# EAGLE design PIR_LedStrip v1.0 (EAGLE 9.6.2)
CNAME: LED Strip; DESIGNER: Miroslav Pivovarsky; REV: 1.0
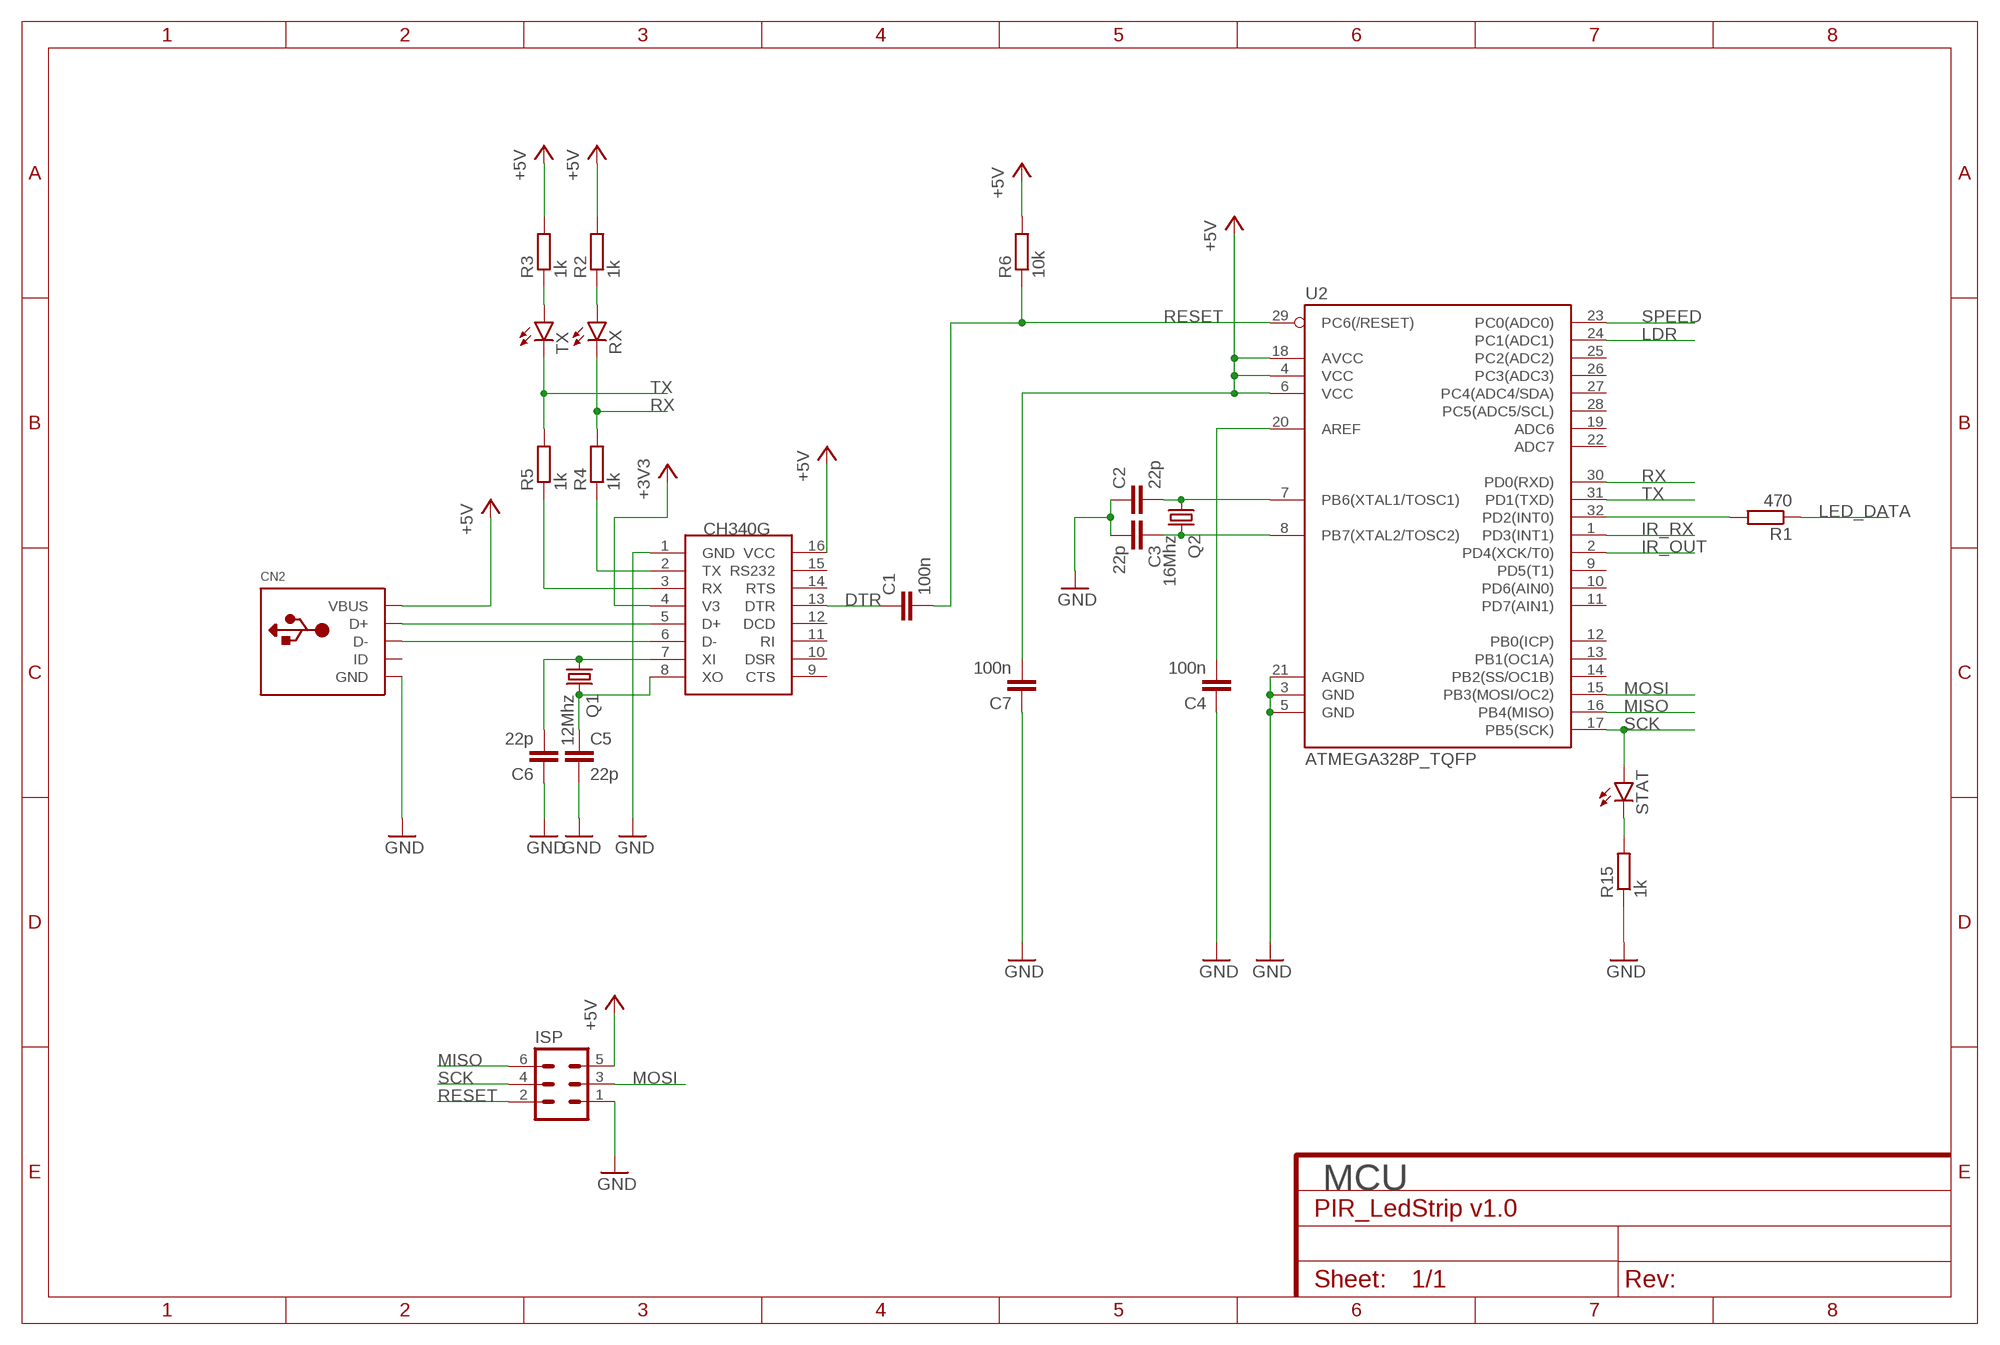
[diagram p0: schematic, sheet 1, part 1 of 2]
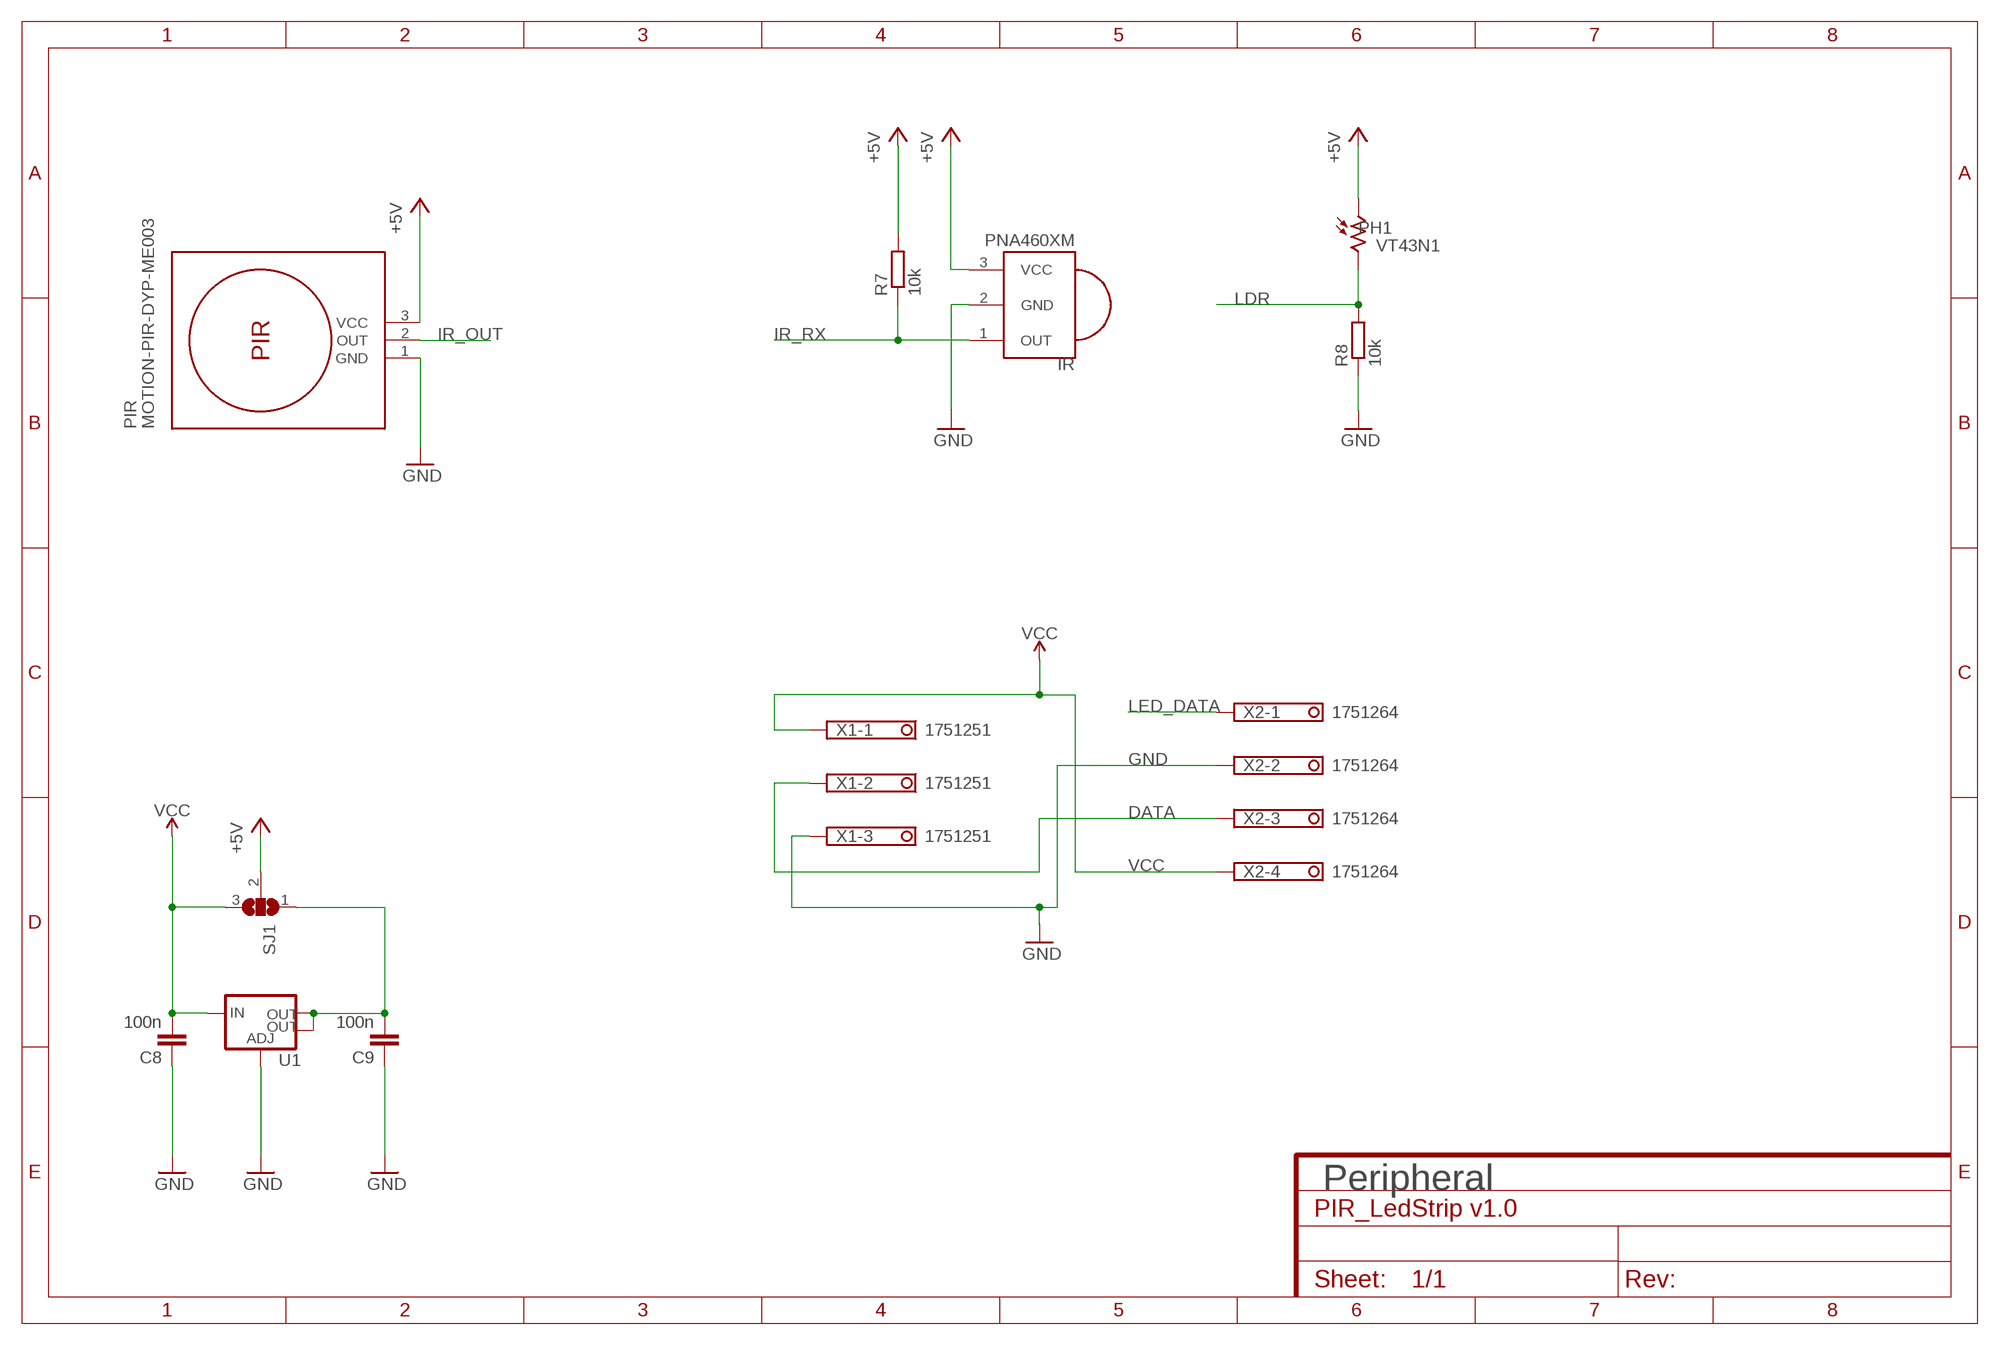
[diagram p1: schematic, sheet 1, part 2 of 2]

## Parts
C1  100n  C-EUC0603  [C0603]
C2  22p  C-EUC0603  [C0603]
C3  22p  C-EUC0603  [C0603]
C4  100n  C-EUC0603  [C0603]
C5  22p  C-EUC0603  [C0603]
C6  22p  C-EUC0603  [C0603]
C7  100n  C-EUC0603  [C0603]
C8  100n  C-EUC0603  [C0603]
C9  100n  C-EUC0603  [C0603]
CN2  USBMINIB  [USB-MINIB]
IR  PNA460XM  [PNA460XM]
ISP  MA03-2  [MA03-2]
PH1  VT43N1  [VT400]
PIR  MOTION-PIR-DYP-ME003  [MOTION-PIR-DYP-ME003]
Q1  12Mhz  CRYSTALHC49UP  [HC49UP]
Q2  16Mhz  CRYSTALHC49UP  [HC49UP]
R1  470  R-EU_R0603  [R0603]
R2  1k  R-EU_R0603  [R0603]
R3  1k  R-EU_R0603  [R0603]
R4  1k  R-EU_R0603  [R0603]
R5  1k  R-EU_R0603  [R0603]
R6  10k  R-EU_R0603  [R0603]
R7  10k  R-EU_R0603  [R0603]
R8  10k  R-EU_R0603  [R0603]
R15  1k  R-EU_R0603  [R0603]
RX  LEDSML0805  [SML0805]
SJ1  SJ2W  [SJ_2]
STAT  LEDSML0805  [SML0805]
TX  LEDSML0805  [SML0805]
U1  V_REG_LM1117SOT223  [SOT223]
U2  ATMEGA328P_TQFP  [TQFP32-08]
U$1  CH340G  [SOIC16]
X1  1751251  [1751251]
X2  1751264  [1751264]

## Nets
+3V3: U$1.4(V3)
+5V: C7.2 CN2.VBUS IR.3(VCC) ISP.5 PH1.1 PIR.3(VCC) R2.2 R3.2 R6.2 R7.2 SJ1.2 U2.4(VCC) U2.6(VCC) U2.18(AVCC) U$1.16(VCC)
DATA: X1.2 X2.3
DTR: C1.1 U$1.13(DTR)
GND: C2.1 C3.2 C4.1 C5.2 C6.1 C7.1 C8.1 C9.1 CN2.GND IR.2(GND) ISP.1 PIR.1(GND) R8.1 R15.1 U1.1(ADJ) U2.3(GND) U2.5(GND) U2.21(AGND) U$1.1(GND) X1.3 X2.2
IR_OUT: PIR.2(OUT) U2.2(PD4(XCK/T0))
IR_RX: IR.1(OUT) R7.1 U2.1(PD3(INT1))
LDR: PH1.2 R8.2 U2.24(PC1(ADC1))
LED_DATA: R1.1 X2.1
MISO: ISP.6 U2.16(PB4(MISO))
MOSI: ISP.3 U2.15(PB3(MOSI/OC2))
N$1: CN2.D+ U$1.5(D+)
N$2: R1.2 U2.32(PD2(INT0))
N$3: CN2.D- U$1.6(D-)
N$4: R5.1 U$1.3(RX)
N$5: R4.1 U$1.2(TX)
N$6: C2.2 Q2.1 U2.7(PB6(XTAL1/TOSC1))
N$7: C6.2 Q1.1 U$1.7(XI)
N$8: C5.1 Q1.2 U$1.8(XO)
N$9: R2.1 RX.A
N$10: R3.1 TX.A
N$11: C3.1 Q2.2 U2.8(PB7(XTAL2/TOSC2))
N$12: C4.2 U2.20(AREF)
N$15: C9.2 SJ1.1 U1.2(OUT) U1.4(OUT)
N$16: R15.2 STAT.C
RESET: C1.2 ISP.2 R6.1 U2.29(PC6(/RESET))
RX: R4.2 RX.C U2.30(PD0(RXD))
SCK: ISP.4 STAT.A U2.17(PB5(SCK))
SPEED: U2.23(PC0(ADC0))
TX: R5.2 TX.C U2.31(PD1(TXD))
VCC: C8.2 SJ1.3 U1.3(IN) X1.1 X2.4
Unconnected: CN2.ID U2.9(PD5(T1)) U2.10(PD6(AIN0)) U2.11(PD7(AIN1)) U2.12(PB0(ICP)) U2.13(PB1(OC1A)) U2.14(PB2(SS/OC1B)) U2.19(ADC6) U2.22(ADC7) U2.25(PC2(ADC2)) U2.26(PC3(ADC3)) U2.27(PC4(ADC4/SDA)) U2.28(PC5(ADC5/SCL)) U$1.9(CTS) U$1.10(DSR) U$1.11(RI) U$1.12(DCD) U$1.14(RTS) U$1.15(RS232)

## Notes on the sheet
- MCU | Peripheral

## Library data of the parts
C1-C9 = rcl:C-EU: CAPACITOR, European symbol; SPICEPREFIX: C
CN2 = adafruit:USB: USB Connectors USBMINIB - Surface Mount Female Mini-B USB Connector 4UConnector: 06564 By microbuilder.eu Thru-hole RA Female Mini-B USB Connector 4UConnector: 18732 By ladyada.net
IR = adafruit:PNA460XM: IR 38KHz receiver PNA4602 and related receivers http://www.ladyada.net/library/pcb/eaglelibrary.html
ISP = con-lstb:MA03-2: PIN HEADER; OC_FARNELL: unknown; OC_NEWARK: unknown
PH1 = photo-elements:VT43N: Photoconductive Cell VT400 Series Source: http://optoelectronics.perkinelmer.com/content/Datasheets/DTS_vt400seriesdatasheet.pdf
PIR = acs712:MOTION-PIR-DYP-ME003: PIR Motion Sensor Module DYP-ME003 based on BISS0001 pyroelectic detector Click here to find device on ebay.com <http://www.ebay.com/sch/dyp+me003>
Q1 Q2 = adafruit:CRYSTAL: CRYSTAL; OC_FARNELL: unknown; OC_NEWARK: unknown
R1-R8 R15 = rcl:R-EU_: RESISTOR, European symbol; SPICEPREFIX: R
RX STAT TX = led:LED: LED OSRAM: - CHIPLED LG R971, LG N971, LY N971, LG Q971, LY Q971, LO R971, LY R971 LH N974, LH R974 LS Q976, LO Q976, LY Q976 LO Q996 - Hyper CHIPLED LW Q18S LB Q993, LB Q99A, LB R99A - SideLED LS A670, LO A670, LY A670, LG A670, LP A670 LB A673, LV A673, LT A673, LW A673 LH A674 LY A675 LS A676, LA A676, LO A676, LY A676, LW A676 LS A679, LY A679, LG A679 - Hyper Micro SIDELED® LS Y876, LA Y876, LO Y876, LY Y876 LT Y87S - SmartLED LW L88C, LW L88S LB L89C, LB L89S, LG L890 LS L89K, LO L89K, LY L89K LS L896, LA L896, LO L896, LY L896 - TOPLED LS T670, LO T670, LY T670, LG T670, LP T670 LSG T670, LSP T670, LSY T670, LOP T670, LYG T670 LG T671, LOG T671, LSG T671 LB T673, LV T673, LT T673, LW T673 LH T674 LS T676, LA T676, LO T676, LY T676, LB T676, LH T676, LSB T676, LW T676 LB T67C, LV T67C, LT T67C, LS T67K, LO T67K, LY T67K, LW E67C LS E67B, LA E67B, LO E67B, LY E67B, LB E67C, LV E67C, LT E67C LW T67C LS T679, LY T679, LG T679 LS T770, LO T770, LY T770, LG T770, LP T770 LB T773, LV T773, LT T773, LW T773 LH T774 LS E675, LA E675, LY E675, LS T675 LS T776, LA T776, LO T776, LY T776, LB T776 LHGB T686 LT T68C, LB T68C - Hyper Mini TOPLED® LB M676 - Mini TOPLED Santana® LG M470 LS M47K, LO M47K, LY M47K Source: http://www.osram.convergy.de LUXEON: - LUMILED® LXK2-PW12-R00, LXK2-PW12-S00, LXK2-PW14-U00, LXK2-PW14-V00 LXK2-PM12-R00, LXK2-PM12-S00, LXK2-PM14-U00 LXK2-PE12-Q00, LXK2-PE12-R00, LXK2-PE12-S00, LXK2-PE14-T00, LXK2-PE14-U00 LXK2-PB12-K00, LXK2-PB12-L00, LXK2-PB12-M00, LXK2-PB14-N00, LXK2-PB14-P00, LXK2-PB14-Q00 LXK2-PR12-L00, LXK2-PR12-M00, LXK2-PR14-Q00, LXK2-PR14-R00 LXK2-PD12-Q00, LXK2-PD12-R00, LXK2-PD12-S00 LXK2-PH12-R00, LXK2-PH12-S00 LXK2-PL12-P00, LXK2-PL12-Q00, LXK2-PL12-R00 Source: www.luxeon.com KINGBRIGHT: KA-3528ASYC Source: www.kingbright.com
SJ1 = jumper:SJ2W: SMD solder JUMPER
U1 = SparkFun-IC-Power:V_REG_LM1117: Voltage Regulator LM1117 Standard adjustable voltage regulator but in SMD form. Spark Fun Electronics SKU : COM-00595; PROD_ID: VREG-08170
U2 = SparkFun-DigitalIC:ATMEGA328P_TQFP; PROD_ID: IC-09069
U$1 = ch340g:CH340G
X1 = con-phoenix-350:1751251: MKDS 1/ 3-3,5 Printklemme Nennstrom: 10 A Bemessungsspannung: 160 V Raster: 3,5 mm Polzahl: 3 Montageart: Löten Anschlussart: Schraubanschluss Anschlussrichtung vom Leiter zur Platine: 0° Source: http://eshop.phoenixcontact.com .. 1751251.pdf; OC_FARNELL: unknown; OC_NEWARK: unknown
X2 = con-phoenix-350:1751264: MKDS 1/ 4-3,5 Printklemme Nennstrom: 10 A Bemessungsspannung: 160 V Raster: 3,5 mm Polzahl: 4 Montageart: Löten Anschlussart: Schraubanschluss Anschlussrichtung vom Leiter zur Platine: 0° Source: http://eshop.phoenixcontact.com .. 1751264.pdf; MPN: 1751264; OC_FARNELL: unknown; OC_NEWARK: 10R0934

## Board
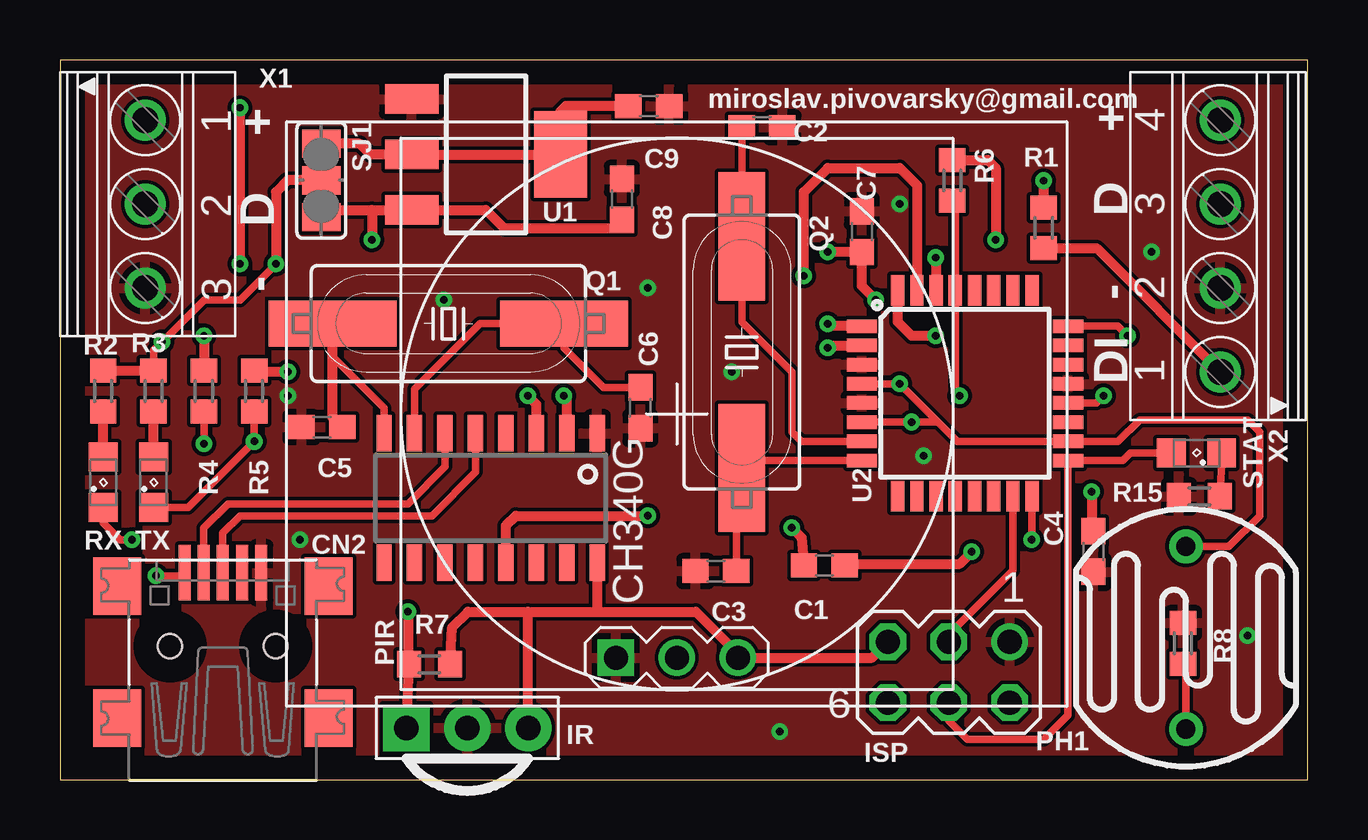
[diagram p2: board, top side]
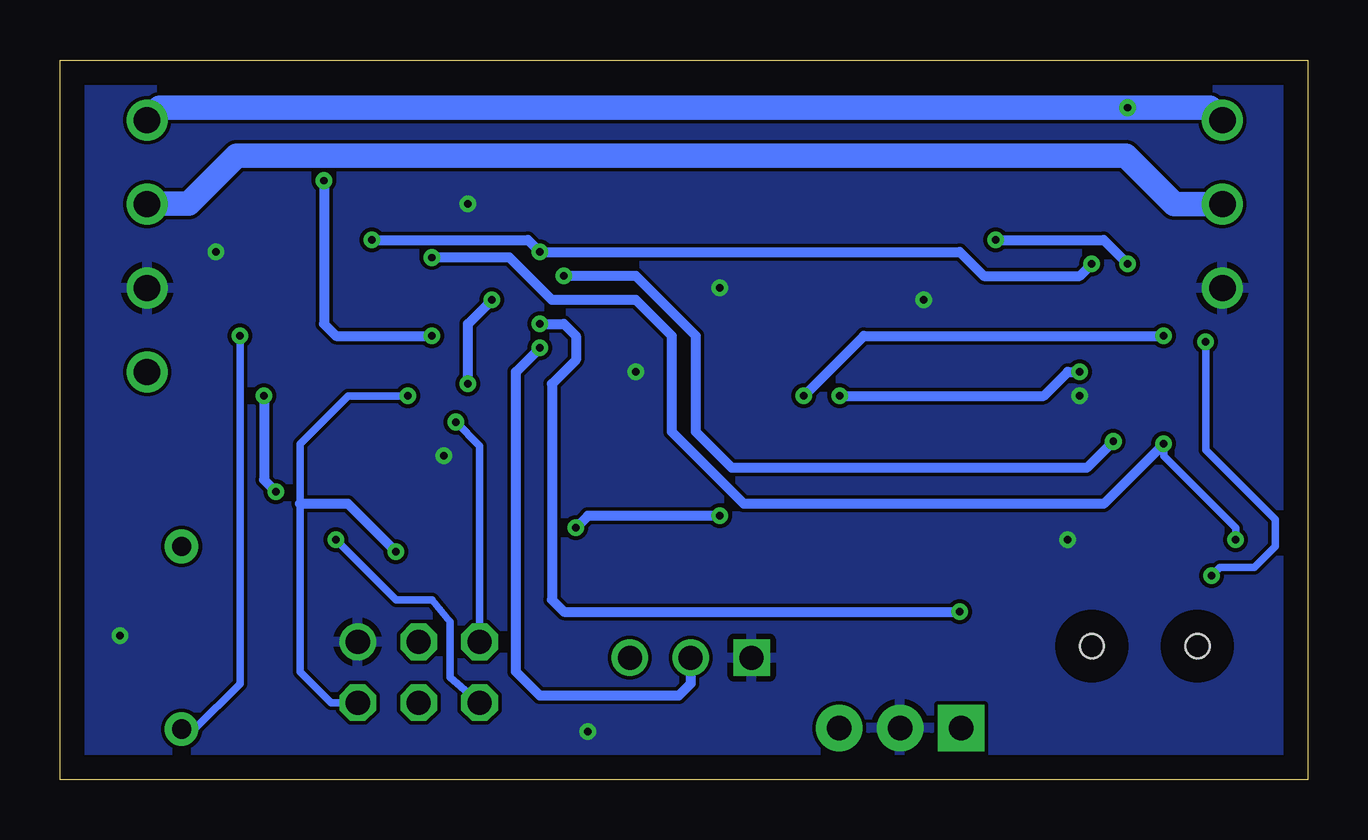
[diagram p3: board, bottom side, seen from below]

Size 52 x 30 mm. Coordinates in mm from the lower left corner, seen from the top.
Outline: 0,0 52,0 52,30 0,30 0,0
Copper layers (1*16): Top 0.035mm / dielectric 1.5mm / Bottom 0.035mm
Design rules "default *": minimum track width 6mil, minimum drill 0.35mm, track to track 6mil, track to pad 6mil, pad to pad 6mil, via to via 6mil, smd to smd 6mil, copper to edge 40mil, drill to drill 6mil, minimum pad ring 10mil, minimum via ring 8mil, stop-mask expansion 4mil, vias tented up to drill 20mil, thermal gap 10mil

### Footprints (pad centres in the part's own frame; a part is rotated, then mirrored left to right if it is on the bottom)
C0603 = smd 1.1 x 1: 1 -0.85,0; 2 0.85,0
USB-MINIB = smd 0.5 x 2.308: D+ 0,4.064; D- -0.8,4.064; GND 1.6,4.064; ID 0.8,4.064; VBUS -1.6,4.064 | smd 2 x 2.4: GND1 -4.4,-2; GND2 -4.4,3.5; GND3 4.4,3.5; GND4 4.4,-2 | hole 1: -2.2,1; 2.2,1
PNA460XM = drill 1.016 pad 1.93 square: 1 -2.54,0 | drill 1.016 pad 1.93: 2 0,0; 3 2.54,0
MA03-2 = drill 1.016: 1 -2.54,-1.27 | drill 1.016 octagon: 2 -2.54,1.27; 3 0,-1.27; 4 0,1.27; 5 2.54,-1.27; 6 2.54,1.27
VT400 = drill 0.8 pad 1.4: 1 -3.81,0; 2 3.81,0
MOTION-PIR-DYP-ME003 = drill 1 square: 1 -2.54,-10.16 | drill 1: 2 0,-10.16; 3 2.54,-10.16
HC49UP = smd 5.334 x 1.93: 1 -4.826,0; 2 4.826,0
R0603 = smd 1 x 1.1: 1 -0.85,0; 2 0.85,0
SML0805 = smd 1.2 x 1.2: A 1.05,0; C -1.05,0
SJ_2 = smd 1.168 x 1.6: 1 -1.524,0; 2 0,0; 3 1.524,0
SOT223 = smd 1.219 x 2.235: 1 -2.311,-3.099; 2 0,-3.099; 3 2.311,-3.099 | smd 3.6 x 2.2: 4 0,3.099
TQFP32-08 = smd 1.27 x 0.559: 1 -4.293,2.8; 2 -4.293,2; 3 -4.293,1.2; 4 -4.293,0.4; 5 -4.293,-0.4; 6 -4.293,-1.2; 7 -4.293,-2; 8 -4.293,-2.8; 17 4.293,-2.8; 18 4.293,-2; 19 4.293,-1.2; 20 4.293,-0.4; 21 4.293,0.4; 22 4.293,1.2; 23 4.293,2; 24 4.293,2.8 | smd 0.559 x 1.27: 9 -2.8,-4.293; 10 -2,-4.293; 11 -1.2,-4.293; 12 -0.4,-4.293; 13 0.4,-4.293; 14 1.2,-4.293; 15 2,-4.293; 16 2.8,-4.293; 25 2.8,4.293; 26 2,4.293; 27 1.2,4.293; 28 0.4,4.293; 29 -0.4,4.293; 30 -1.2,4.293; 31 -2,4.293; 32 -2.8,4.293
SOIC16 = smd 0.635 x 1.524: 1 -4.445,-2.695; 2 -3.175,-2.695; 3 -1.905,-2.695; 4 -0.635,-2.695; 5 0.635,-2.695; 6 1.905,-2.695; 7 3.175,-2.695; 8 4.445,-2.695; 9 4.445,2.695; 10 3.175,2.695; 11 1.905,2.695; 12 0.635,2.695; 13 -0.635,2.695; 14 -1.905,2.695; 15 -3.175,2.695; 16 -4.445,2.695
1751251 = drill 1.1 pad 1.7: 1 -3.5,-0.1; 2 0,-0.1; 3 3.5,-0.1
1751264 = drill 1.1 pad 1.7: 1 -5.25,-0.1; 2 -1.75,-0.1; 3 1.75,-0.1; 4 5.25,-0.1

### Placement (x,y rotation side)
C1  31.86,8.92 0 top
C2  29.26,27.19 180 top
C3  27.34,8.69 180 top
C4  43.08,9.51 90 top
C5  10.92,14.69 180 top
C6  24.19,15.5 90 top
C7  33.42,22.84 270 top
C8  23.42,24.19 270 top
C9  24.54,28.08 180 top
CN2  6.79,4.56 0 top
IR  16.98,2.15 0 top
ISP  37.05,4.47 180 top
PH1  46.93,5.91 270 top
PIR  25.71,15.24 0 top
Q1  16.19,19.01 180 top
Q2  28.42,17.82 270 top
R1  41,23 90 top
R2  1.8,16.2 90 top
R3  3.9,16.2 90 top
R4  6,16.2 270 top
R5  8.1,16.2 270 top
R6  37.19,24.98 90 top
R7  15.4,4.81 0 top
R8  46.81,5.68 270 top
R15  47.49,11.81 0 top
RX  1.8,12.4 90 top
SJ1  10.89,24.98 270 top
STAT  47.37,13.61 180 top
TX  3.9,12.4 90 top
U1  17.76,26.06 270 top
U2  37.72,16.1 0 top
U$1  17.95,11.74 180 top
X1  3.65,23.99 270 top
X2  48.27,22.24 90 top

### Tracks (layer width: path | path; a pad name or v marks a point on that pad's centre or on a via)
+5V  (via drill 0.3)
  Top 0.305: U2.4 v35,16.5 36.6,14.9 | 36.6,14.9 37.4,14.1 U2.18 44.1,14.1 45,15 49.5,15 50,14.5 50,11 48.72,9.72 PH1.1 | U2.6 v35.5,14.9 36.6,14.9 | R3.2 3.9,17.9 v4.25,18.25 6,20 7.5,20 v9,21.5 | CN2.VBUS 5.07,8.5 v4,8.5
  Top 0.406: SJ1.2 9.48,24.98 9,24.5 v9,21.5 | U$1.16 22.39,7.11 22.5,7 | 22.5,7 26.5,7 28.25,5.25 PIR.3 33.85,5.08 ISP.5 | R7.2 16.35,6.35 17,7 19.5,7 | 19.5,7 22.5,7 | IR.3 19.52,6.98 19.5,7 | R2.2 R3.2 | v34,20 33.42,20.58 C7.2 v32,22 | R6.2 38.67,25.83 39,25.5 v39,22.5
  Bottom 0.305: ISP.5 34.51,13.91 v35.5,14.9 | v4,8.5 3.66,8.84 2.23,8.84 1.34,9.73 1.34,10.84 4.25,13.75 v4.25,18.25
  Bottom 0.406: v34,20 35,19 v35,16.5 | v9,21.5 9.5,21 13.5,21 14.5,22 v32,22 32.5,22.5 v39,22.5
DATA
  Bottom 1.016: X1.2 5.55,23.99 7.57,26.01 44.63,26.01 46.63,24.01 48.35,24.01 X2.3
DTR  (via drill 0.3)
  Top 0.406: U$1.13 18.59,10.59 19,11 v24.5,11 | v30.5,10.5 30.91,10.09 C1.1
  Bottom 0.406: v24.5,11 30,11 v30.5,10.5
GND  (via drill 0.3)
  other vias: 10,10 9.5,16 24.5,20.5 45.5,22 36,13.5 30,2 49.5,6 16,20 28,17 35,24
  pour Top: 0,30 52,30 52,0 0,0
  pour Bottom: 0,30 52,30 52,0 0,0
IR_OUT  (via drill 0.3)
  Top 0.406: v32,18 32.1,18.1 U2.2
  Bottom 0.406: PIR.2 25.71,4 26.21,3.5 32,3.5 33,4.5 33,17 v32,18
IR_RX  (via drill 0.3)
  Top 0.406: IR.1 R7.1 14.5,4.86 v14.5,7 | U2.1 32.1,18.9 v32,19
  Bottom 0.406: v32,19 31,19 30.5,18.5 30.5,17.5 31.5,16.5 31.5,7.5 31,7 v14.5,7
LDR  (via drill 0.3)
  Top 0.305: PH1.2 46.93,4.61 R8.2 | U2.24 44.1,18.9 v44.5,18.5
  Bottom 0.305: v44.5,18.5 44.5,4 46.4,2.1 PH1.2
LED_DATA
  Top 0.406: R1.1 43.21,22.15 X2.1
MISO  (via drill 0.3)
  Top 0.305: U2.16 40.52,10.02 v40.5,10
  Bottom 0.305: v40.5,10 38,7.5 36.5,7.5 35.75,6.58 35.75,4.27 ISP.6
MOSI
  Top 0.305: U2.15 39.72,8.72 37.05,6.05 ISP.3
N$1
  Top 0.305: CN2.D+ 6.79,10.29 7.5,11 15.5,11 17.32,12.81 U$1.5
N$2  (via drill 0.3)
  Top 0.406: R1.2 v41,24.97 | v36.5,18.5 35.5,18.5 34.92,19.08 U2.32
  Bottom 0.406: v41,24.97 41,19 40.5,18.5 v36.5,18.5
N$3
  Top 0.305: CN2.D- 5.99,10.49 7,11.5 14.5,11.5 16.05,13.04 U$1.6
N$4  (via drill 0.3)
  Top 0.406: U$1.3 19.86,15.64 v19.5,16 | v9.5,17 8.15,17 R5.1
  Bottom 0.406: v19.5,16 11,16 10,17 v9.5,17
N$5  (via drill 0.3)
  Top 0.406: U$1.2 21.12,15.88 v21,16 | v6,18.5 R4.1
  Bottom 0.406: v21,16 18.5,18.5 v6,18.5
N$6
  Top 0.305: U2.7 30.9,14.1 30.5,14.5 30.5,17 28.42,19.08 Q2.1 28.42,27.08 C2.2
N$7
  Top 0.305: U$1.7 14.78,16.27 17.51,19.01 21,19.01 | 21,19.01 Q1.1 | C6.2 22.65,16.35 21,18 21,19.01
N$8
  Top 0.305: U$1.8 13.5,15.5 11.36,17.64 Q1.2
  Top 0.406: C5.1 11.36,15.1 Q1.2
N$9
  Top 0.406: RX.A R2.1
N$10
  Top 0.406: TX.A R3.1
N$11
  Top 0.305: U2.8 28.73,13.3 Q2.2 | 28.19,12.76 C3.1
  Top 0.406: Q2.2 28.19,12.76
N$12  (via drill 0.3)
  Top 0.305: U2.20 43.2,15.7 v43.5,16
  Top 0.406: v43,12 43,10.44 C4.2
  Bottom 0.406: v43.5,16 43.5,12.5 v43,12
N$15
  Top 0.406: SJ1.1 12.5,26.5 12.94,26.06 U1.2 U1.4 20.86,27.86 21.08,28.08 C9.2
N$16
  Top 0.305: STAT.C 48.44,13.59 R15.2
RESET  (via drill 0.3)
  Top 0.305: v37.5,16 37.32,16.18 U2.29 37.32,24 R6.1
  Top 0.406: C1.2 32.89,9 37.5,9 v38,9.5
  Bottom 0.305: v37.5,16 40,16 42,14 42,11.5 42,4.5 40.7,3.2 ISP.2
  Bottom 0.406: v38,9.5 40,11.5 42,11.5
RX  (via drill 0.3)
  Top 0.305: R4.2 v6,14 | v3,10 2.5,10 1.8,10.7 RX.C
  Top 0.406: v36.5,21.77 36.52,21.75 U2.30
  Bottom 0.305: v6,14 6,13.5 3,10.5 v3,10
  Bottom 0.406: v6,14 8.5,11.5 23.5,11.5 26.5,14.5 26.5,18.5 28,20 31.5,20 33.27,21.77 v36.5,21.77
SCK
  Top 0.305: STAT.A 44.61,13.61 44.3,13.3 U2.17 42.01,2.68 41,1.67 37.83,1.67 37.05,2.45 ISP.4
TX  (via drill 0.3)
  Top 0.305: R5.2 v8.1,14.1 5.35,11.35 TX.C
  Top 0.406: U2.31 35.72,24.78 35,25.5 32,25.5 31,24.5 v31,21
  Bottom 0.406: v8.1,14.1 9.2,13 24,13 25.5,14.5 25.5,18.5 28,21 v31,21
VCC  (via drill 0.3)
  Top 0.406: SJ1.3 11.18,23.75 13,23.75 | 13,23.75 U1.3 17.75,23.75 18.5,23 23.18,23 C8.2 | 13,23.75 v13,22.5 | v7.5,21.5 v7.5,28.01
  Bottom 0.406: v13,22.5 8.5,22.5 v7.5,21.5
  Bottom 1.016: X1.1 4.07,28.01 v7.5,28.01 47.85,28.01 X2.4

### Text on the board
tNames: + | miroslav.pivovarsky@gmail.com | + | D | D | - | - | DI